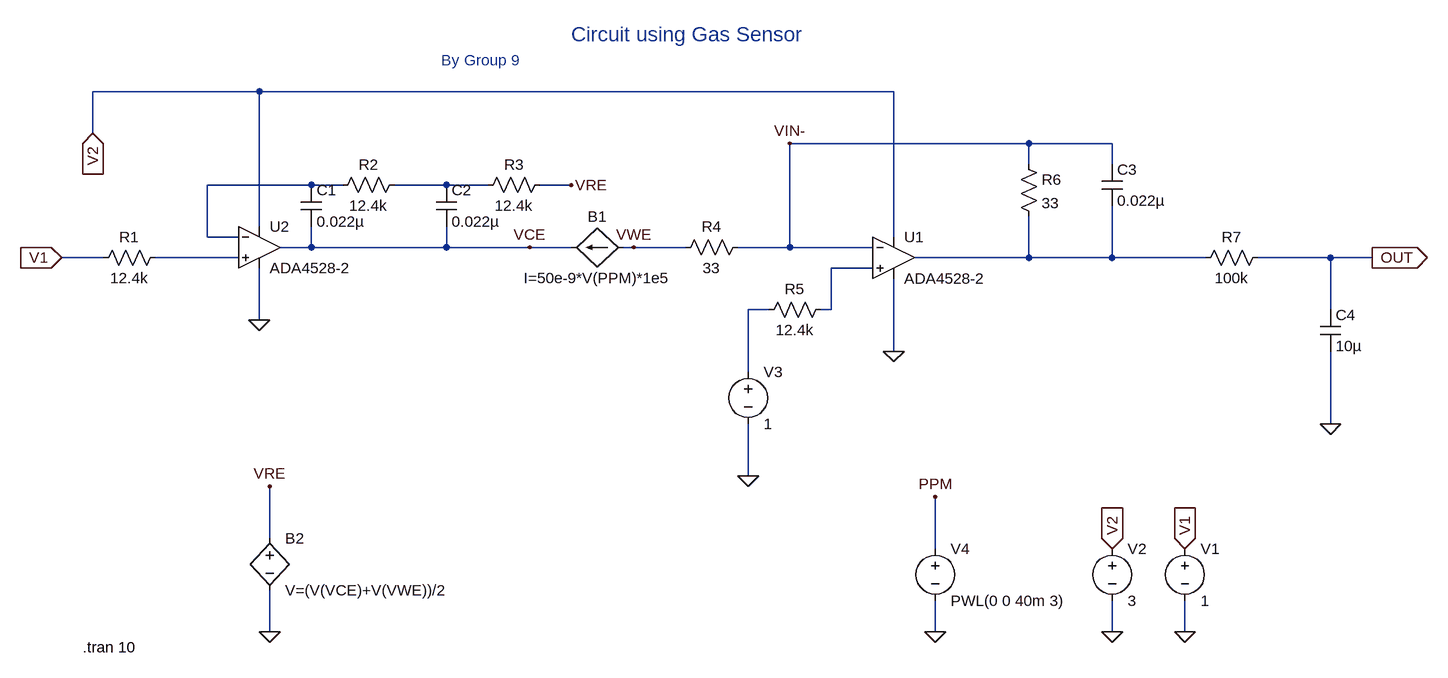
[diagram p0: schematic Gas Sensor.asc]
Gas Sensor.asc, the LTspice schematic file:
Version 4
SHEET 1 880 680
WIRE -1104 -624 -1360 -624
WIRE -128 -624 -1104 -624
WIRE -1360 -560 -1360 -624
WIRE 80 -544 -288 -544
WIRE 208 -544 80 -544
WIRE 80 -512 80 -544
WIRE 208 -512 208 -544
WIRE -1024 -480 -1184 -480
WIRE -976 -480 -1024 -480
WIRE -816 -480 -896 -480
WIRE -752 -480 -816 -480
WIRE -624 -480 -672 -480
WIRE -1104 -416 -1104 -624
WIRE -1184 -400 -1184 -480
WIRE -1136 -400 -1184 -400
WIRE -128 -400 -128 -624
WIRE -1024 -384 -1024 -416
WIRE -1024 -384 -1072 -384
WIRE -816 -384 -816 -416
WIRE -816 -384 -1024 -384
WIRE -688 -384 -816 -384
WIRE -624 -384 -688 -384
WIRE -528 -384 -544 -384
WIRE -448 -384 -528 -384
WIRE -288 -384 -288 -544
WIRE -288 -384 -368 -384
WIRE -160 -384 -288 -384
WIRE -1344 -368 -1408 -368
WIRE -1136 -368 -1264 -368
WIRE 80 -368 80 -432
WIRE 80 -368 -96 -368
WIRE 208 -368 208 -448
WIRE 208 -368 80 -368
WIRE 352 -368 208 -368
WIRE 544 -368 432 -368
WIRE 608 -368 544 -368
WIRE -160 -352 -224 -352
WIRE -320 -288 -352 -288
WIRE -224 -288 -224 -352
WIRE -224 -288 -240 -288
WIRE 544 -288 544 -368
WIRE -1104 -272 -1104 -352
WIRE -128 -224 -128 -336
WIRE -352 -192 -352 -288
WIRE 544 -112 544 -224
WIRE -352 -32 -352 -112
WIRE -1088 64 -1088 -16
WIRE -64 80 -64 0
WIRE -1088 208 -1088 144
WIRE -64 208 -64 160
WIRE 208 208 208 160
WIRE 320 208 320 160
FLAG 208 208 0
FLAG 320 208 0
FLAG 320 80 V1
IOPIN 320 80 In
FLAG 208 80 V2
IOPIN 208 80 In
FLAG 544 -112 0
FLAG 608 -368 OUT
IOPIN 608 -368 Out
FLAG -128 -224 0
FLAG -352 -32 0
FLAG -288 -544 VIN-
FLAG -528 -384 VWE
FLAG -624 -480 VRE
FLAG -688 -384 VCE
FLAG -1104 -272 0
FLAG -1360 -560 V2
IOPIN -1360 -560 In
FLAG -1408 -368 V1
IOPIN -1408 -368 In
FLAG -64 0 PPM
FLAG -64 208 0
FLAG -1088 208 0
FLAG -1088 -16 VRE
SYMBOL voltage 320 64 R0
WINDOW 123 0 0 Left 0
WINDOW 39 0 0 Left 0
SYMATTR InstName V1
SYMATTR Value 1
SYMBOL voltage 208 64 R0
WINDOW 123 0 0 Left 0
WINDOW 39 0 0 Left 0
SYMATTR InstName V2
SYMATTR Value 3
SYMBOL voltage -352 -208 R0
WINDOW 123 0 0 Left 0
WINDOW 39 0 0 Left 0
SYMATTR InstName V3
SYMATTR Value 1
SYMBOL voltage -64 64 R0
SYMATTR InstName V4
SYMATTR Value PWL(0 0 40m 3)
SYMBOL bi -544 -384 R90
WINDOW 0 -32 40 VBottom 2
WINDOW 3 32 40 VTop 2
SYMATTR InstName B1
SYMATTR Value I=50e-9*V(PPM)*1e5
SYMBOL bv -1088 48 R0
SYMATTR InstName B2
SYMATTR Value V=(V(VCE)+V(VWE))/2
SYMBOL cap -1040 -480 R0
SYMATTR InstName C1
SYMATTR Value 0.022µ
SYMBOL cap -832 -480 R0
SYMATTR InstName C2
SYMATTR Value 0.022µ
SYMBOL cap 192 -512 R0
SYMATTR InstName C3
SYMATTR Value 0.022µ
SYMBOL cap 528 -288 R0
SYMATTR InstName C4
SYMATTR Value 10µ
SYMBOL res -1248 -384 R90
WINDOW 0 0 56 VBottom 2
WINDOW 3 32 56 VTop 2
SYMATTR InstName R1
SYMATTR Value 12.4k
SYMBOL res -880 -496 R90
WINDOW 0 0 56 VBottom 2
WINDOW 3 32 56 VTop 2
SYMATTR InstName R2
SYMATTR Value 12.4k
SYMBOL res -656 -496 R90
WINDOW 0 0 56 VBottom 2
WINDOW 3 32 56 VTop 2
SYMATTR InstName R3
SYMATTR Value 12.4k
SYMBOL res -352 -400 R90
WINDOW 0 0 56 VBottom 2
WINDOW 3 32 56 VTop 2
SYMATTR InstName R4
SYMATTR Value 33
SYMBOL res -224 -304 R90
WINDOW 0 0 56 VBottom 2
WINDOW 3 32 56 VTop 2
SYMATTR InstName R5
SYMATTR Value 12.4k
SYMBOL res 64 -528 R0
SYMATTR InstName R6
SYMATTR Value 33
SYMBOL res 448 -384 R90
WINDOW 0 0 56 VBottom 2
WINDOW 3 32 56 VTop 2
SYMATTR InstName R7
SYMATTR Value 100k
SYMBOL OpAmps\\ADA4528-2 -128 -432 R0
SYMATTR InstName U1
SYMBOL OpAmps\\ADA4528-2 -1104 -448 R0
SYMATTR InstName U2
TEXT -1376 232 Left 2 !.tran 10
TEXT -624 -712 Left 3 ;Circuit using Gas Sensor
TEXT -824 -672 Left 2 ;By Group 9

The netlist it stands for:
* Gas Sensor.asc
V1 V1 0 1
V2 V2 0 3
V3 N006 0 1
V4 PPM 0 PWL(0 0 40m 3)
B1 VWE VCE I=50e-9*V(PPM)*1e5
B2 VRE 0 V=(V(VCE)+V(VWE))/2
C1 N001 VCE 0.022µ
C2 N002 VCE 0.022µ
C3 VIN- N004 0.022µ
C4 OUT 0 10µ
R1 N003 V1 12.4k
R2 N002 N001 12.4k
R3 VRE N002 12.4k
R4 VIN- VWE 33
R5 N005 N006 12.4k
R6 VIN- N004 33
R7 OUT N004 100k
XU1 N005 VIN- V2 0 N004 ADA4528-2  ; pins In+ In- V+ V- OUT
XU2 N003 N001 V2 0 VCE ADA4528-2  ; pins In+ In- V+ V- OUT
.tran 10
* Circuit using Gas Sensor
* By Group 9
.backanno
.end